# EAGLE design RJ45_connector (EAGLE 7.0.0)
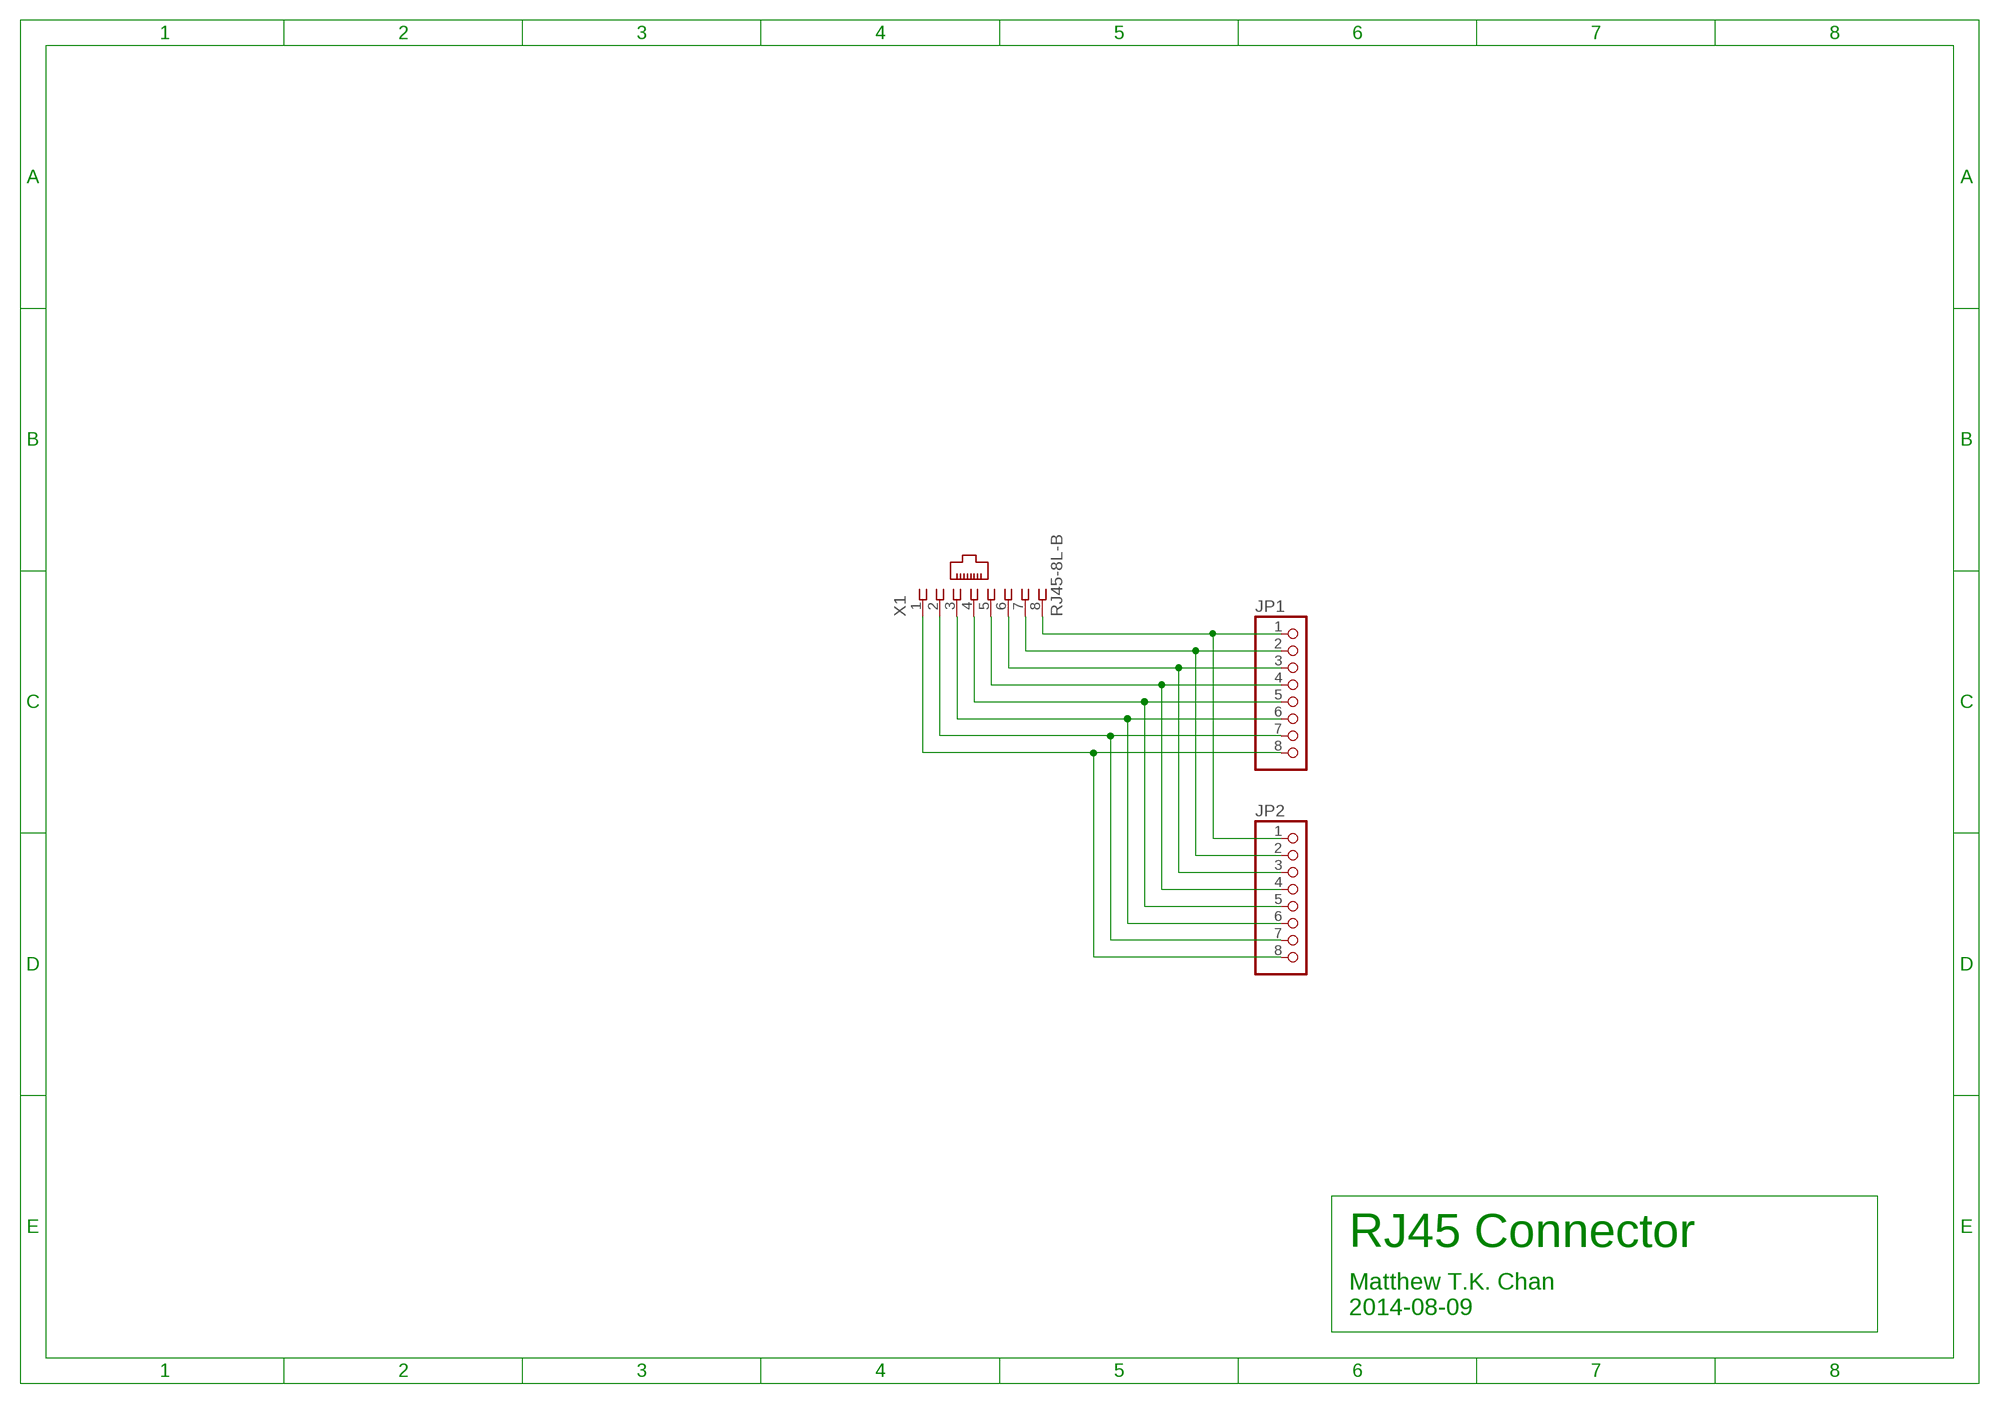
[diagram p0: schematic, sheet 1]

## Parts
JP1  PINHD-1X8/90  [1X08/90]
JP2  PINHD-1X8/90  [1X08/90]
X1  RJ45-8L-B  [RJ45-NO-SHIELD]

## Nets
N$1: JP1.1 JP2.1 X1.8
N$2: JP1.2 JP2.2 X1.7
N$3: JP1.3 JP2.3 X1.6
N$4: JP1.4 JP2.4 X1.5
N$5: JP1.5 JP2.5 X1.4
N$6: JP1.6 JP2.6 X1.3
N$7: JP1.7 JP2.7 X1.2
N$8: JP1.8 JP2.8 X1.1

## Notes on the sheet
- RJ45 Connector
- Matthew T.K. Chan
  2014-08-09

## Library data of the parts
JP1 JP2 = CBLA_Test_bed_Library:PINHD-1X8: PIN HEADER
X1 = CBLA_Test_bed_Library:RJ45: CORCOM Modular RJ Jacks No Shield Source: www.tycoelectronics.com .. ENG_DS_1654001_1099_RJ_L_0507.pdf; MF: TYCO ELECTRONICS; MPN: RJ45-8L-B; OC_FARNELL: 1279843; OC_NEWARK: 52K4445

## Board
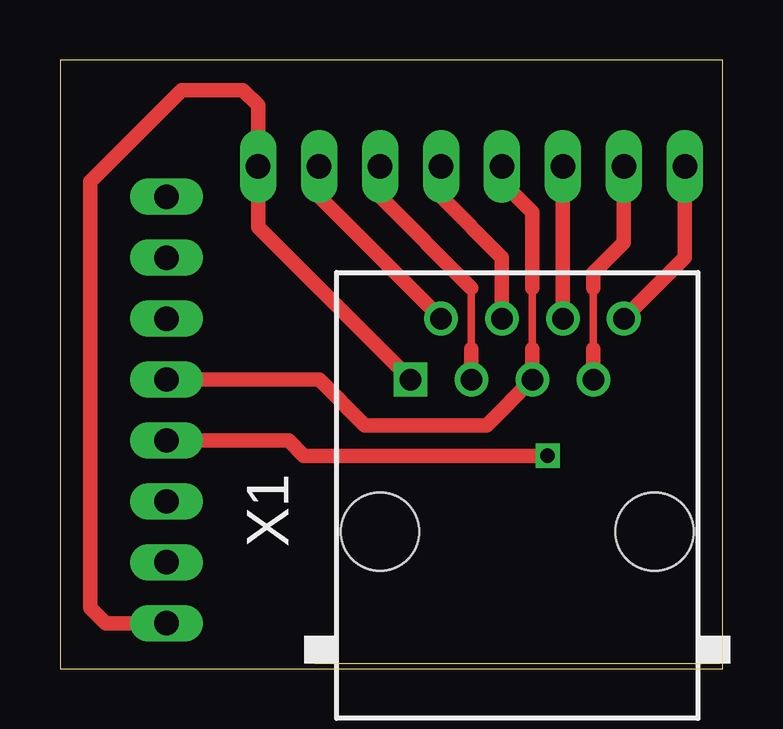
[diagram p1: board, top side]
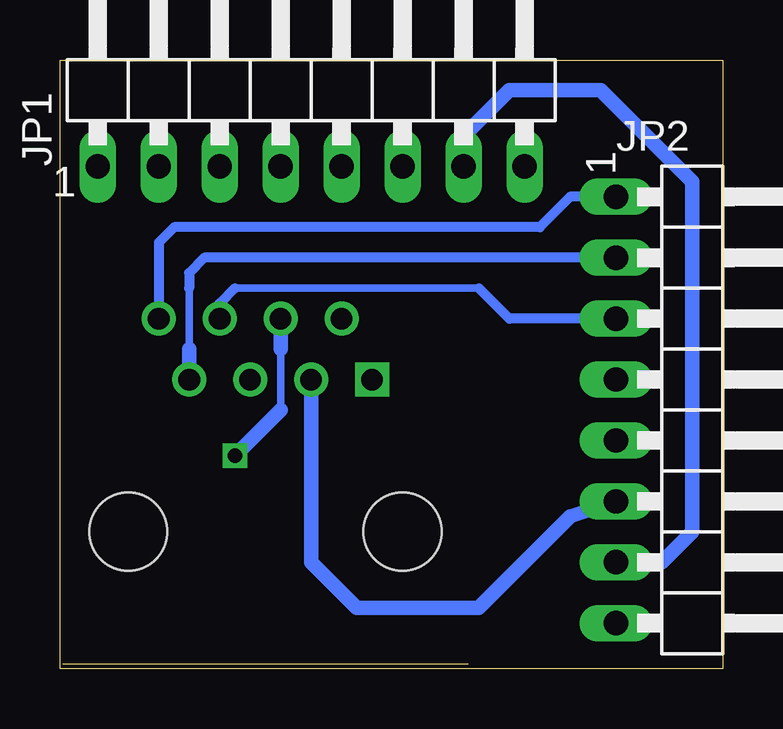
[diagram p2: board, bottom side, seen from below]

Size 27.61 x 25.39 mm. Coordinates in mm from the lower left corner, seen from the top.
Outline: 0,0 27.61,0 27.61,25.39 0,25.39 0,0
Copper layers (1*16): Top 0.035mm / dielectric 1.5mm / Bottom 0.035mm
Design rules "default *": minimum track width 10mil, minimum drill 20mil, track to track 15mil, track to pad 15mil, pad to pad 15mil, via to via 15mil, smd to smd 8mil, copper to edge 24mil, drill to drill 8mil, minimum pad ring 10mil, minimum via ring 8mil, stop-mask expansion 4mil, vias tented up to drill 0mil, thermal gap 10mil

### Footprints (pad centres in the part's own frame; a part is rotated, then mirrored left to right if it is on the bottom)
1X08/90 = drill 1.016 long: 1 -8.89,-3.81; 2 -6.35,-3.81; 3 -3.81,-3.81; 4 -1.27,-3.81; 5 1.27,-3.81; 6 3.81,-3.81; 7 6.35,-3.81; 8 8.89,-3.81
RJ45-NO-SHIELD = drill 0.9 pad 1.4 square: 1 -4.445,6.35 | drill 0.9 pad 1.4: 2 -3.175,8.89; 3 -1.905,6.35; 4 -0.635,8.89; 5 0.635,6.35; 6 1.905,8.89; 7 3.175,6.35; 8 4.445,8.89 | hole 3.251: -5.715,0; 5.715,0

### Placement (x,y rotation side)
JP1  17.14,24.77 0 bottom
JP2  0.64,10.79 270 bottom
X1  19.05,5.71 0 top

### Tracks (layer width: path | path; a pad name or v marks a point on that pad's centre or on a via)
N$1
  Top 0.61: JP1.1 26.04,17.14 X1.8
  Bottom 0.406: X1.8 23.5,17.78 22.86,18.41 7.62,18.41 6.35,19.68 JP2.1
N$2
  Top 0.305: 22.23,15.88 22.23,13.34
  Top 0.61: JP1.2 23.5,17.78 22.23,16.51 22.23,15.88 | X1.7 22.23,13.34
  Bottom 0.305: 22.23,15.88 22.23,13.34
  Bottom 0.406: JP2.2 21.59,17.14 22.23,16.51 22.23,15.88
  Bottom 0.61: 22.23,13.34 X1.7
N$3
  Top 0.61: JP1.3 X1.6
  Bottom 0.305: 10.16,15.88 20.32,15.88
  Bottom 0.406: 20.32,15.88 20.95,15.24 X1.6 | JP2.3 8.89,14.61 10.16,15.88
N$4
  Top 0.305: 19.68,15.88 19.68,13.34
  Top 0.61: 19.68,13.34 X1.5 17.78,10.16 12.7,10.16 10.79,12.06 JP2.4 | 19.68,15.88 19.68,19.05 18.41,20.32 JP1.4
N$5  (via drill 0.6)
  Top 0.61: JP1.5 15.88,19.68 18.41,17.14 X1.4 | JP2.5 9.53,9.53 10.16,8.89 v20.32,8.89
  Bottom 0.305: 18.41,13.34 18.41,10.79
  Bottom 0.61: X1.4 18.41,13.34 | 18.41,10.79 v20.32,8.89
N$6
  Top 0.305: 17.14,15.88 17.14,13.34
  Top 0.61: JP1.6 13.34,19.68 17.14,15.88 | X1.3 17.14,13.34
  Bottom 0.61: JP2.6 6.35,6.35 10.16,2.54 15.24,2.54 17.14,4.45 X1.3
N$7
  Top 0.61: JP1.7 10.79,19.68 X1.2
  Bottom 0.61: JP2.7 2.54,4.45 1.27,5.71 1.27,20.32 5.08,24.13 8.89,24.13 10.79,22.23 JP1.7
N$8
  Top 0.61: X1.1 8.26,18.41 JP1.8 8.26,23.5 7.62,24.13 5.08,24.13 1.27,20.32 1.27,2.54 1.91,1.91 JP2.8